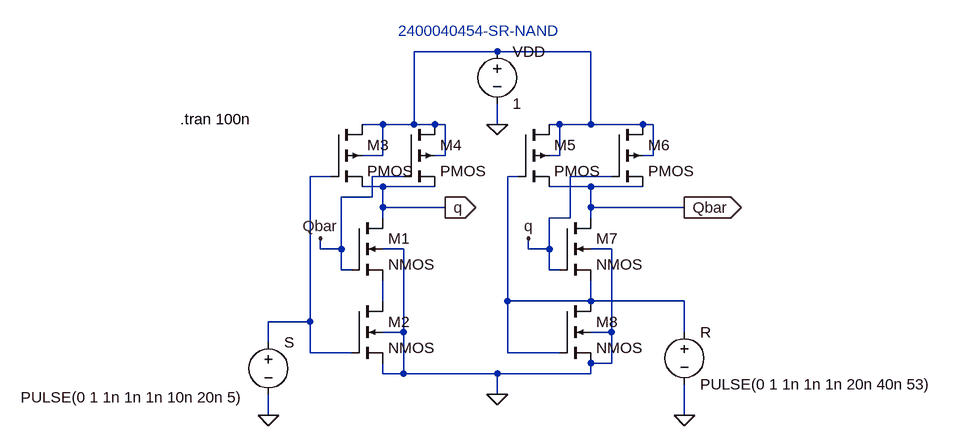
[diagram p0: schematic SR-NAND.asc]
SR-NAND.asc, the LTspice schematic file:
Version 4.1
SHEET 1 964 680
WIRE 272 -144 144 -144
WIRE 416 -144 272 -144
WIRE 96 -32 64 -32
WIRE 144 -32 144 -144
WIRE 144 -32 96 -32
WIRE 176 -32 144 -32
WIRE 192 -32 176 -32
WIRE 272 -32 272 -64
WIRE 368 -32 352 -32
WIRE 416 -32 416 -144
WIRE 416 -32 368 -32
WIRE 496 -32 416 -32
WIRE 512 -32 496 -32
WIRE 96 16 96 -32
WIRE 96 16 64 16
WIRE 192 16 192 -32
WIRE 192 16 176 16
WIRE 368 16 368 -32
WIRE 368 16 352 16
WIRE 512 16 512 -32
WIRE 512 16 496 16
WIRE 16 48 -16 48
WIRE 128 48 80 48
WIRE 304 48 288 48
WIRE 448 48 384 48
WIRE 96 64 64 64
WIRE 176 64 96 64
WIRE 416 64 352 64
WIRE 496 64 416 64
WIRE 80 80 80 48
WIRE 80 80 32 80
WIRE 96 96 96 64
WIRE 192 96 96 96
WIRE 416 96 416 64
WIRE 560 96 416 96
WIRE 96 112 96 96
WIRE 384 112 384 48
WIRE 384 112 352 112
WIRE 416 112 416 96
WIRE 0 160 0 144
WIRE 32 160 32 80
WIRE 32 160 0 160
WIRE 128 160 96 160
WIRE 320 160 320 144
WIRE 352 160 352 112
WIRE 352 160 320 160
WIRE 448 160 416 160
WIRE 32 192 32 160
WIRE 48 192 32 192
WIRE 352 192 352 160
WIRE 368 192 352 192
WIRE 96 240 96 208
WIRE 288 240 288 48
WIRE 416 240 416 208
WIRE 416 240 288 240
WIRE 560 240 416 240
WIRE -16 272 -16 48
WIRE -16 272 -80 272
WIRE 128 288 128 160
WIRE 128 288 96 288
WIRE 448 288 448 160
WIRE 448 288 416 288
WIRE 560 288 560 240
WIRE -80 304 -80 272
WIRE -16 320 -16 272
WIRE 48 320 -16 320
WIRE 288 320 288 240
WIRE 368 320 288 320
WIRE 448 336 448 288
WIRE 448 336 416 336
WIRE 96 352 96 336
WIRE 128 352 128 288
WIRE 128 352 96 352
WIRE 272 352 128 352
WIRE 416 352 416 336
WIRE 416 352 272 352
WIRE 272 384 272 352
WIRE -80 416 -80 384
WIRE 560 416 560 368
FLAG 272 384 0
FLAG -80 416 0
FLAG 560 416 0
FLAG 272 -32 0
FLAG 192 96 q
IOPIN 192 96 Out
FLAG 560 96 Qbar
IOPIN 560 96 Out
FLAG 320 144 q
FLAG 0 144 Qbar
SYMBOL nmos4 48 112 R0
SYMATTR InstName M1
SYMBOL nmos4 48 240 R0
SYMATTR InstName M2
SYMBOL pmos4 16 -32 R0
SYMATTR InstName M3
SYMBOL pmos4 128 -32 R0
SYMATTR InstName M4
SYMBOL pmos4 304 -32 R0
SYMATTR InstName M5
SYMBOL pmos4 448 -32 R0
SYMATTR InstName M6
SYMBOL nmos4 368 112 R0
SYMATTR InstName M7
SYMBOL nmos4 368 240 R0
SYMATTR InstName M8
SYMBOL voltage -80 288 R0
WINDOW 3 -381 100 Left 2
WINDOW 123 0 0 Left 0
WINDOW 39 0 0 Left 0
SYMATTR InstName S
SYMATTR Value PULSE(0 1 1n 1n 1n 10n 20n 5)
SYMBOL voltage 560 272 R0
WINDOW 123 0 0 Left 0
WINDOW 39 0 0 Left 0
SYMATTR InstName R
SYMATTR Value PULSE(0 1 1n 1n 1n 20n 40n 53)
SYMBOL voltage 272 -160 R0
WINDOW 123 0 0 Left 0
WINDOW 39 0 0 Left 0
SYMATTR InstName VDD
SYMATTR Value 1
TEXT -216 -40 Left 2 !.tran 100n
TEXT 120 -176 Left 2 ;2400040454-SR-NAND

The netlist it stands for:
* SR-NAND.asc
M1 q Qbar N004 0 NMOS
M2 N004 N002 0 0 NMOS
M3 N001 N002 q N001 PMOS
M4 N001 Qbar q N001 PMOS
M5 N001 N003 Qbar N001 PMOS
M6 N001 q Qbar N001 PMOS
M7 Qbar q N003 0 NMOS
M8 N003 N003 0 0 NMOS
V§S N002 0 PULSE(0 1 1n 1n 1n 10n 20n 5)
V§R N003 0 PULSE(0 1 1n 1n 1n 20n 40n 53)
VDD N001 0 1
.model NMOS NMOS
.model PMOS PMOS
.lib standard.mos
.tran 100n
* 2400040454-SR-NAND
.backanno
.end